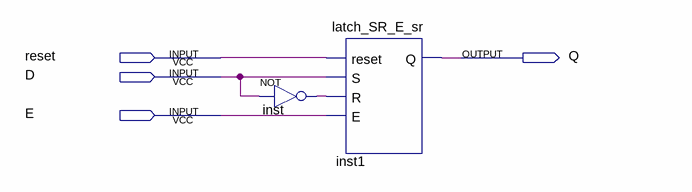
[diagram p0: schematic sheet]
// Quartus schematic latch_D_sr.bdf as structural Verilog: 2 symbols, 4 pins
module latch_D_sr (
  input  reset,
  input  D,
  input  E,
  output Q
);

  wire inst_out;

  not inst (inst_out, D);
  latch_SR_E_sr inst1 (.reset(reset), .S(D), .R(inst_out), .E(E), .Q(Q));
endmodule
